# Altium project RK_NVR_DEMO1_RK3588_LP4XD200P232SD8_V21_20211228.PrjPcb (part 18 of 19)

## Sheet 92.KEY.SchDoc
size 297 x 209 mm; Revision: V2.1; Schematic Page Number: 11; Page Number: 39; Check: Default; Schematic Name: RK_NVR_DEMO1_RK3588_LP4/4x_V21; Page Count: 43; Page name: 92.KEY; Designer: Zhangdz; Schematic Page Count: 99; Revcode: V2.1; DsnPath: E:\Work\SBER\RK3588_SOM\temp\RK_NVR_DEMO1_RK3588_LP4XD200P232SD8_V21_20211228.DSN; SchematicName: RK_NVR_DEMO1_RK3588_LP4/4x_V21; PageName: 92.KEY; PageSize: A4; TopSchematic: True
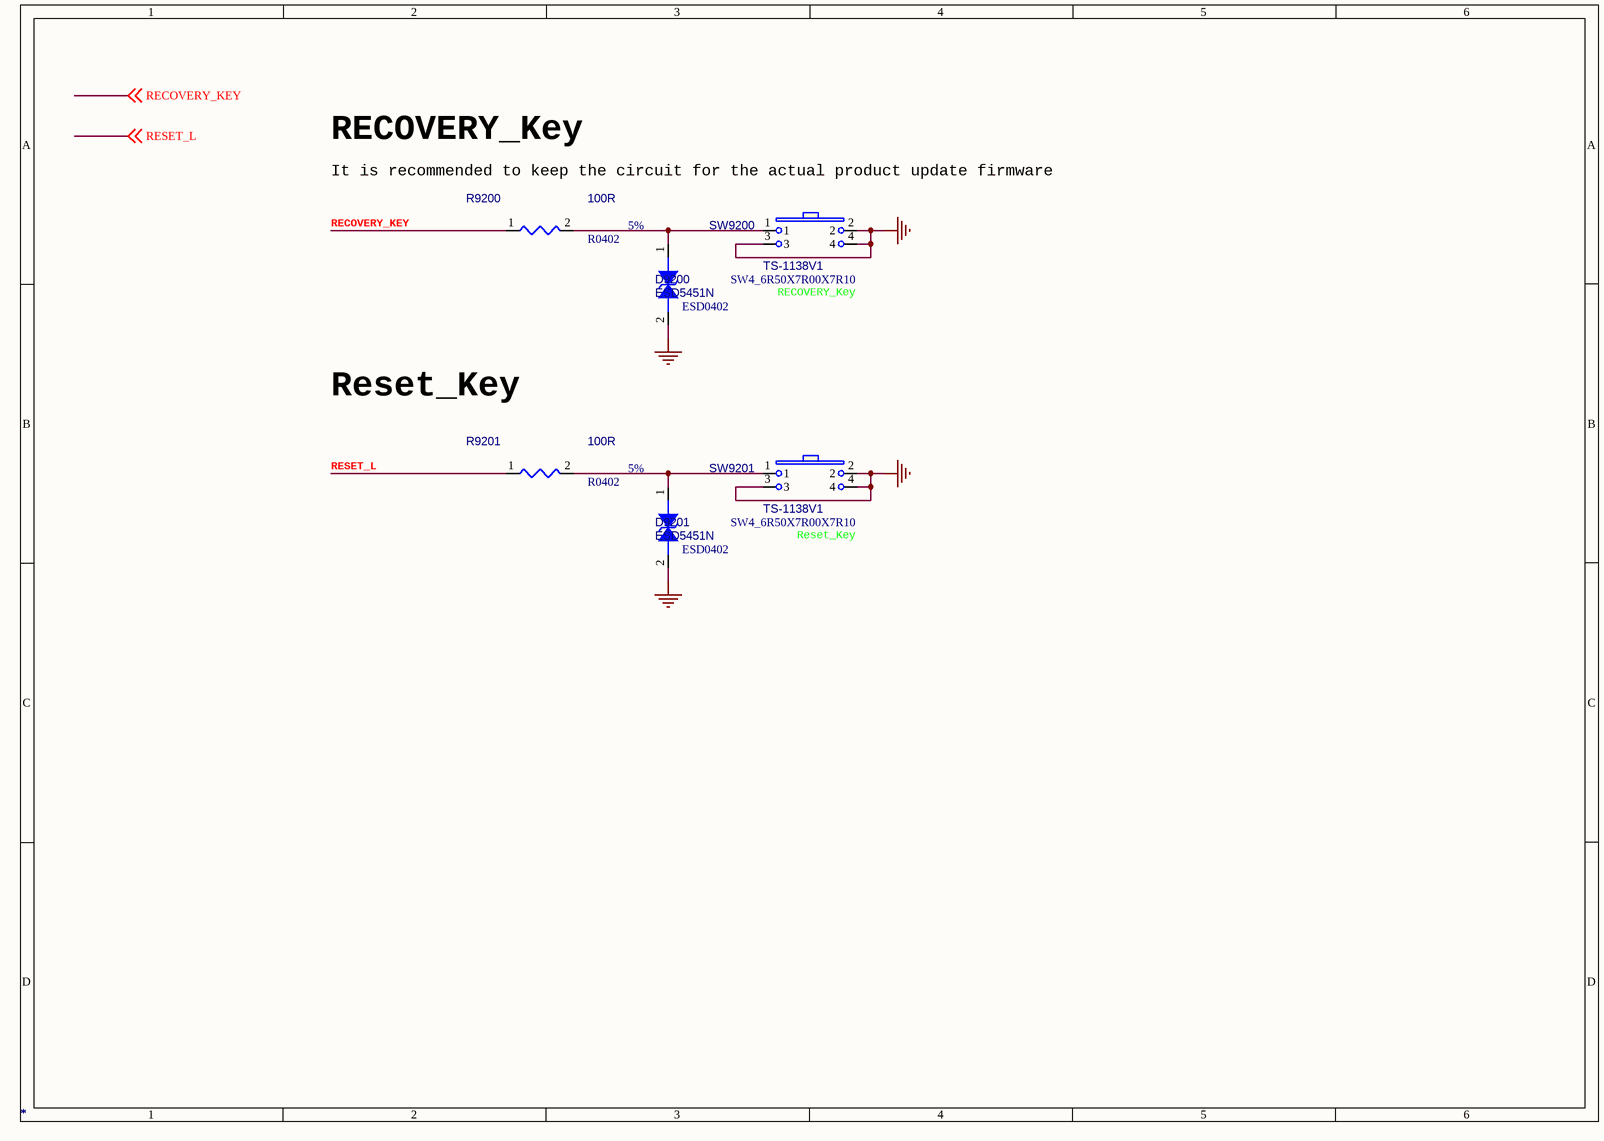
[diagram p75: 92.KEY.SchDoc]

### Parts
D9200  *  [ESD0402]
D9201  *  [ESD0402]
R9200  *  Tolerance: 5%  [R0402]
R9201  *  Tolerance: 5%  [R0402]
SW9200  *  PCB Footprint: SW4_6R50X7R00X7R10  Option: RECOVERY_Key  [YC-6615B]
SW9201  *  PCB Footprint: SW4_6R50X7R00X7R10  Option: Reset_Key  [YC-6615B]

### Nets
GND: D9200.2 D9201.2 SW9200.2 SW9200.3 SW9200.4 SW9201.2 SW9201.3 SW9201.4
RECOVERY_KEY: R9200.1 ; off-sheet RECOVERY_KEY
RESET_L: R9201.1 ; off-sheet RESET_L
NetD9200_1: D9200.1 R9200.2 SW9200.1
NetD9201_1: D9201.1 R9201.2 SW9201.1

### Notes on the sheet
- RECOVERY_Key
- It is recommended to keep the circuit for the actual product update firmware
- Reset_Key

### Library data of the parts
D9200 = DIODE BI_DIR TRIG: 1-Line, Bi-directional, Transient Voltage Suppressors.17.5pF.; Part Reference: D9200; Manufacturer: WillSemi(О¤¶ы°лµјМе); Value: ESD5451N; Priority: A; PCB Footprint: ESD0402; Created by: JJJ; Manufacturer PN: ESD5451N; Part Type: ESD_TVS; RK PN: ESD5451N
D9201 = DIODE BI_DIR TRIG: 1-Line, Bi-directional, Transient Voltage Suppressors.17.5pF.; Part Reference: D9201; Manufacturer: WillSemi(О¤¶ы°лµјМе); Value: ESD5451N; Priority: A; PCB Footprint: ESD0402; Created by: JJJ; Manufacturer PN: ESD5451N; Part Type: ESD_TVS; RK PN: ESD5451N
R9200 = RESISTOR_Dup1: НЁУГєсД¤µзЧи,100R,+/-5%,R0402,1/16W.; Part Reference: R9200; Manufacturer PN: RC0402JR-07100RL; Manufacturer: YAGEO; Wattage: 1/16W; Priority: A; PCB Footprint: R0402; Value: 100R; Created by: YTL; Part Type: НЁУГєсД¤µзЧи; RK PN: RC0402JR-07100RL
R9201 = RESISTOR_Dup1: НЁУГєсД¤µзЧи,100R,+/-5%,R0402,1/16W.; Part Reference: R9201; Manufacturer: YAGEO; RK PN: RC0402JR-07100RL; Priority: A; Wattage: 1/16W; PCB Footprint: R0402; Value: 100R; Part Type: НЁУГєсД¤µзЧи; Manufacturer PN: RC0402JR-07100RL; Created by: YTL
SW9200 = KEY_4PIN: 4ЅЕЈ¬Іа±ЯЈ¬ІејюЈ¬6.5MMx7.1MM°ґјь; Part Reference: SW9200; Manufacturer: Сw»ЄµзЧУ; Value: TS-1138V1; Priority: A; Created by: YWQ; Manufacturer Part Number: TS-1138V1; Part Type: KEY; RK PN: TS-1138V1
SW9201 = KEY_4PIN: 4ЅЕЈ¬Іа±ЯЈ¬ІејюЈ¬6.5MMx7.1MM°ґјь; Part Reference: SW9201; Manufacturer: Сw»ЄµзЧУ; Value: TS-1138V1; Priority: A; RK PN: TS-1138V1; Part Type: KEY; Manufacturer Part Number: TS-1138V1; Created by: YWQ

## Sheet 93.HW_ID.SchDoc
size 297 x 209 mm; Revision: V2.1; Schematic Page Number: 11; Page Number: 40; Check: Default; Schematic Name: RK_NVR_DEMO1_RK3588_LP4/4x_V21; Page Count: 43; Page name: 93.HW_ID; Designer: Zhangdz; Schematic Page Count: 99; Revcode: V2.1; DsnPath: E:\Work\SBER\RK3588_SOM\temp\RK_NVR_DEMO1_RK3588_LP4XD200P232SD8_V21_20211228.DSN; SchematicName: RK_NVR_DEMO1_RK3588_LP4/4x_V21; PageName: 93.HW_ID; PageSize: A4; TopSchematic: True
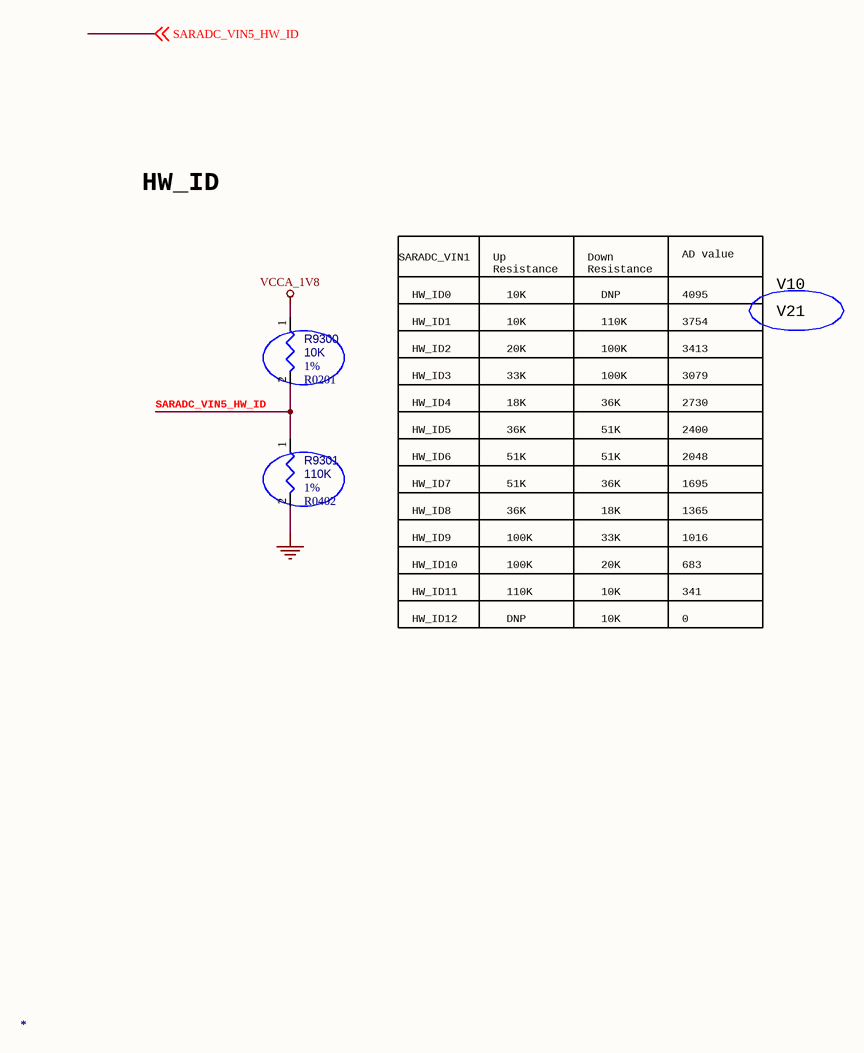
[diagram p76: 93.HW_ID.SchDoc]

### Parts
R9300  *  PCB Footprint: R0201  Tolerance: 1%  [R0402]
R9301  *  Tolerance: 1%  [R0402]

### Nets
GND: R9301.2
VCCA_1V8: R9300.1
SARADC_VIN5_HW_ID: R9300.2 R9301.1 ; off-sheet SARADC_VIN5_HW_ID

### Notes on the sheet
- HW_ID
- SARADC_VIN1
- HW_ID0
- Up
  Resistance
- 10K
- Down
  Resistance
- DNP
- AD value
- 4095
- V10
- V21
- HW_ID1
- HW_ID2
- HW_ID3
- 20K
- 33K
- 110K
- 100K
- 3413
- 3079
- 3754
- HW_ID4
- HW_ID5
- 18K
- 36K
- 51K
- 2730
- 2400
- HW_ID8
- HW_ID7
- HW_ID6
- 2048
- 1695
- 1365
- HW_ID10
- HW_ID9
- 1016
- 683
- HW_ID11
- HW_ID12
- 341
- 0

### Library data of the parts
R9300 = RESISTOR_Dup1: НЁУГєсД¤µзЧи,10K,+/-1%,R0201,1/20W.; Part Reference: R9300; Manufacturer PN: RC0201FR-0710KL; Manufacturer: YAGEO; Wattage: 1/20W; Priority: A; Value: 10K; Created by: YTL; Part Type: НЁУГєсД¤µзЧи; RK PN: RC0201FR-0710KL
R9301 = RESISTOR_Dup1: НЁУГєсД¤µзЧи,110K,+/-1%,R0402,1/16W.; Part Reference: R9301; Manufacturer PN: RC0402FR-07110KL; Manufacturer: YAGEO; Wattage: 1/16W; Priority: A; PCB Footprint: R0402; Value: 110K; Created by: YTL; Part Type: НЁУГєсД¤µзЧи; RK PN: RC0402FR-07110KL

## Sheet 95.RS485_RS232.SchDoc
size 420 x 297 mm; Revision: V2.1; Schematic Page Number: 11; Page Number: 41; Check: Default; Schematic Name: RK_NVR_DEMO1_RK3588_LP4/4x_V21; Page Count: 43; Page name: 95.RS485/RS232; Designer: Zhangdz; Schematic Page Count: 99; Revcode: V2.1; DsnPath: E:\Work\SBER\RK3588_SOM\temp\RK_NVR_DEMO1_RK3588_LP4XD200P232SD8_V21_20211228.DSN; SchematicName: RK_NVR_DEMO1_RK3588_LP4/4x_V21; PageName: 95.RS485/RS232; PageSize: A3; TopSchematic: True
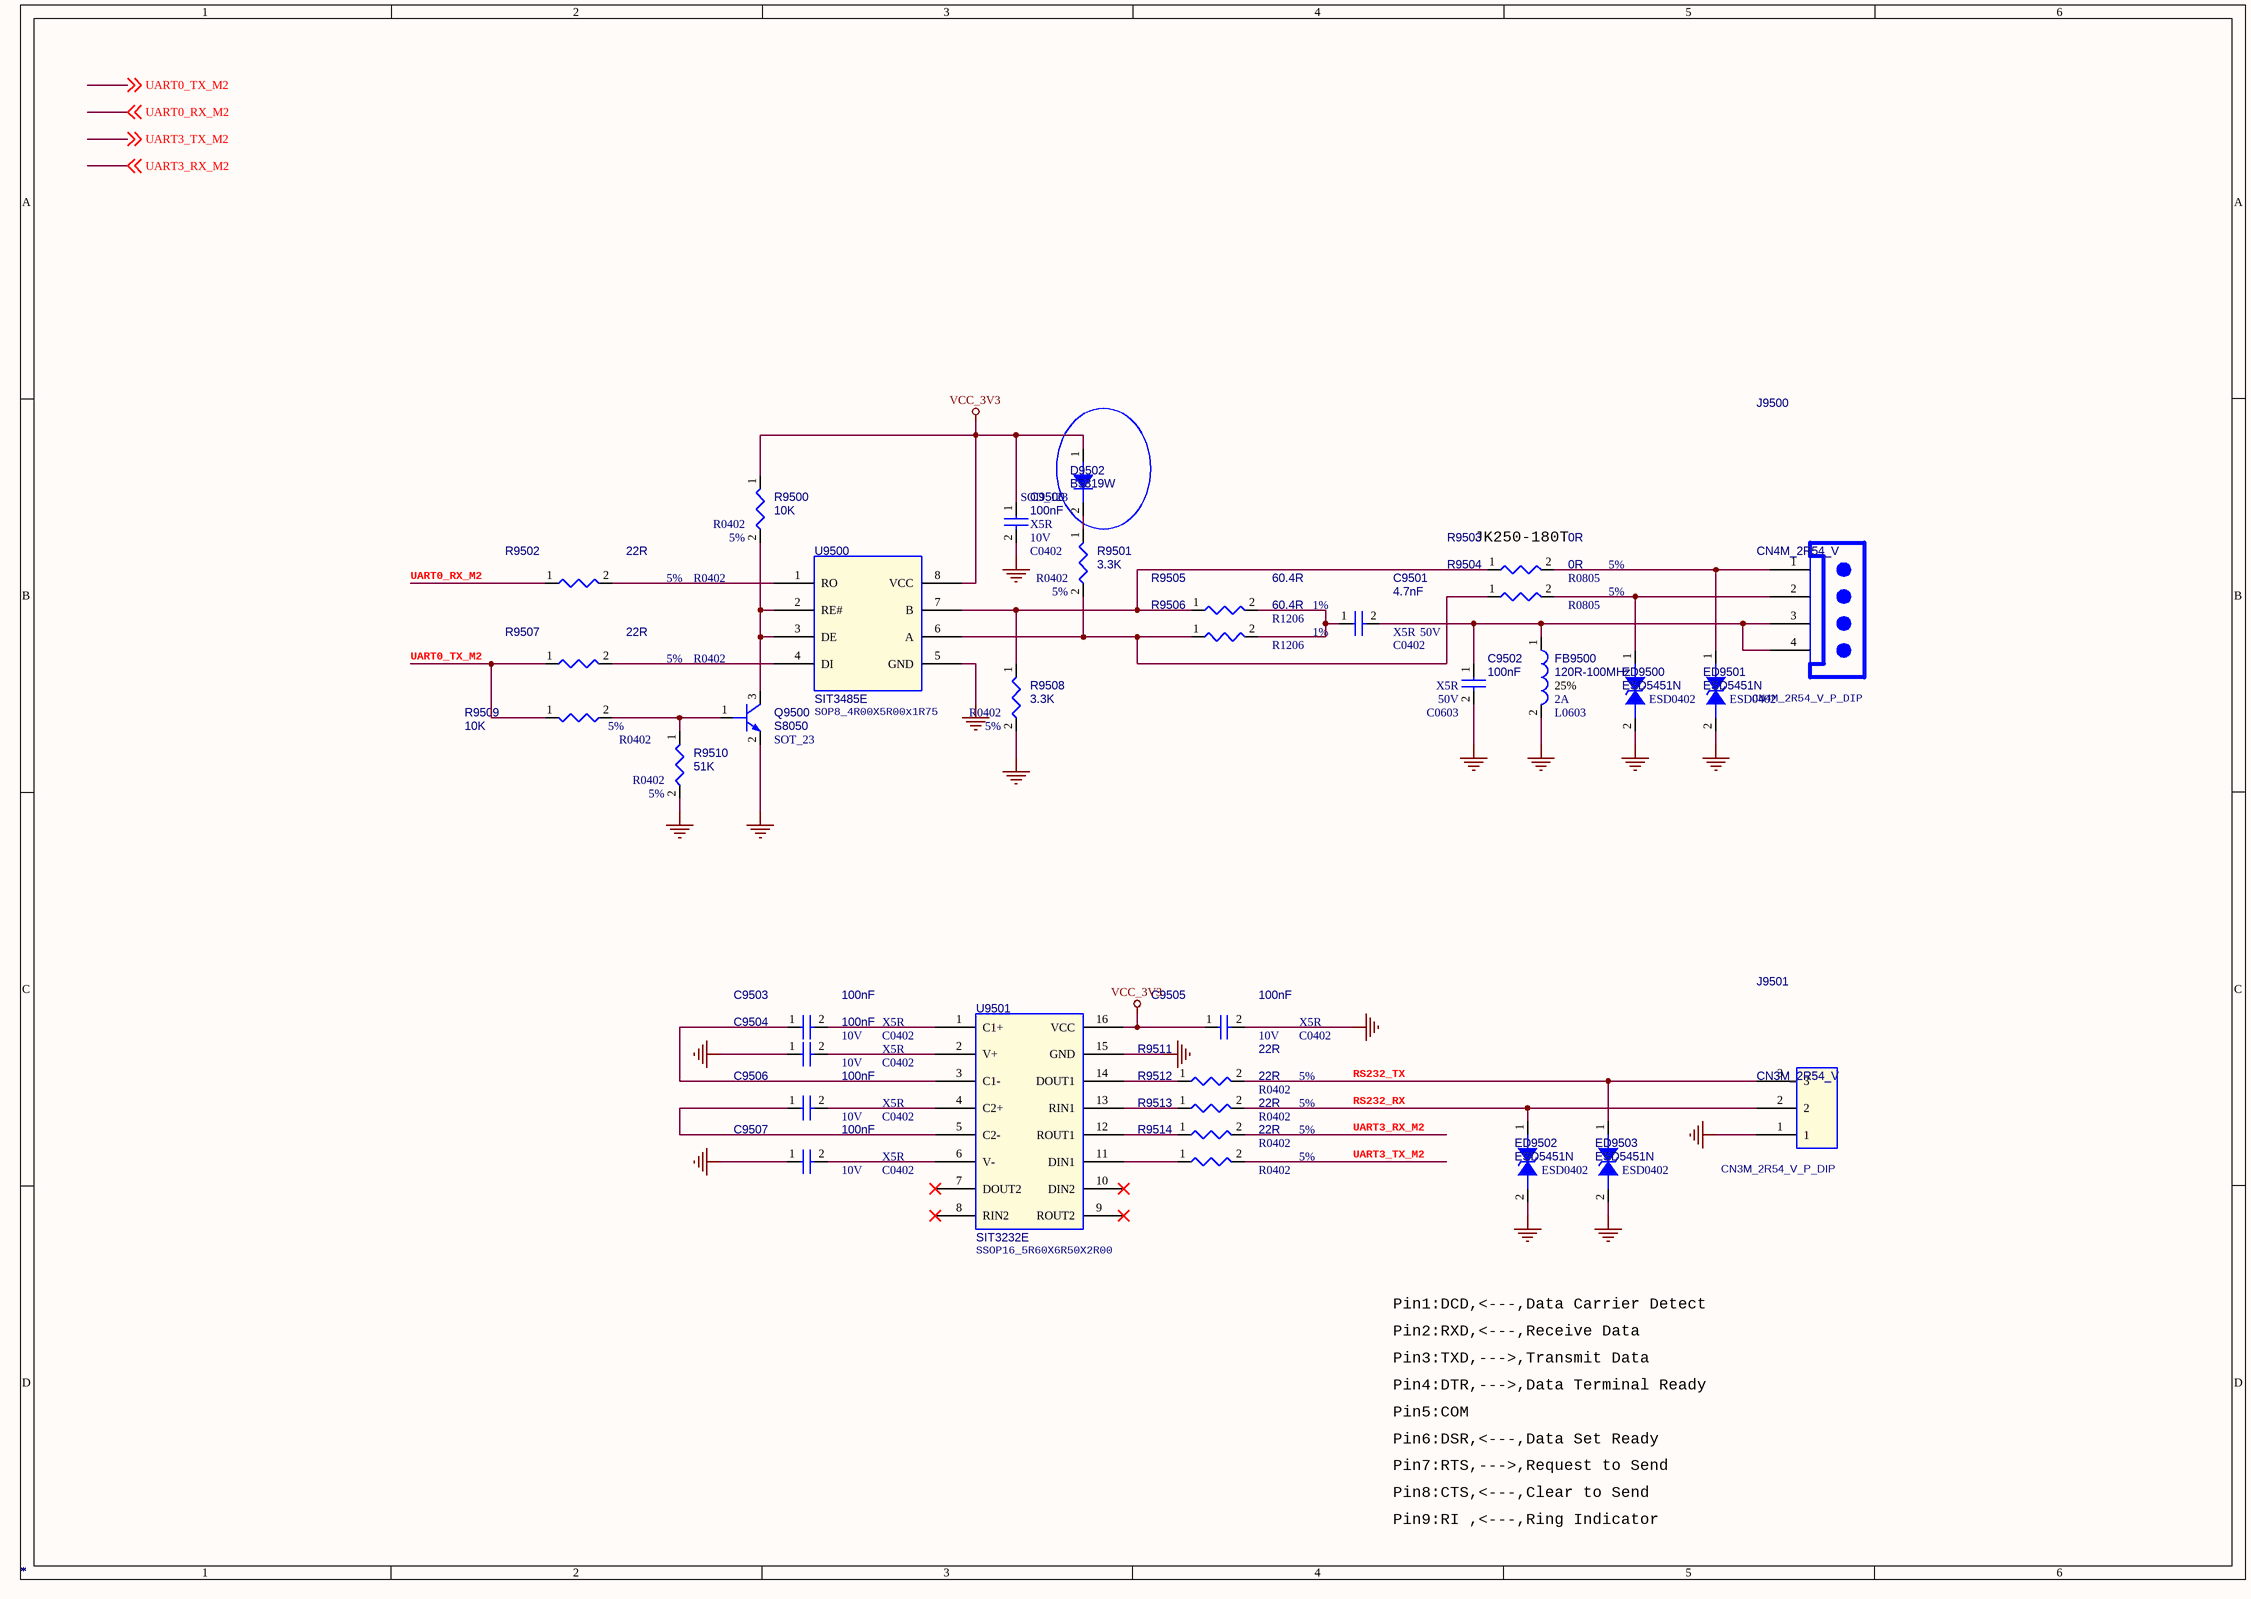
[diagram p77: 95.RS485_RS232.SchDoc]

### Parts
C9500  *  Voltage: 10V  Dielectric: X5R  [C0402]
C9501  *  Voltage: 50V  Dielectric: X5R  [C0402]
C9502  *  Voltage: 50V  Dielectric: X5R  [C0603]
C9503  *  Voltage: 10V  Dielectric: X5R  [C0402]
C9504  *  Voltage: 10V  Dielectric: X5R  [C0402]
C9505  *  Voltage: 10V  Dielectric: X5R  [C0402]
C9506  *  Voltage: 10V  Dielectric: X5R  [C0402]
C9507  *  Voltage: 10V  Dielectric: X5R  [C0402]
D9502  *  [SOD_123]
ED9500  *  [ESD0402]
ED9501  *  [ESD0402]
ED9502  *  [ESD0402]
ED9503  *  [ESD0402]
FB9500  *  Tolerance: 25%  Irms: 2A  [L0603]
J9500  *  [CN4M_2R54_V_P_DIP]
J9501  *  PCB Footprint: CN3M_2R54_V_P_DIP  [DIP3_1X3_2R54]
Q9500  *  [SOT_23]
R9500  *  Tolerance: 5%  [R0402]
R9501  *  Tolerance: 5%  [R0402]
R9502  *  Tolerance: 5%  [R0402]
R9503  *  PCB Footprint: R0805  Tolerance: 5%  [R0402]
R9504  *  PCB Footprint: R0805  Tolerance: 5%  [R0402]
R9505  *  PCB Footprint: R1206  Tolerance: 1%  [R0402]
R9506  *  PCB Footprint: R1206  Tolerance: 1%  [R0402]
R9507  *  Tolerance: 5%  [R0402]
R9508  *  Tolerance: 5%  [R0402]
R9509  *  Tolerance: 5%  [R0402]
R9510  *  Tolerance: 5%  [R0402]
R9511  *  Tolerance: 5%  [R0402]
R9512  *  Tolerance: 5%  [R0402]
R9513  *  Tolerance: 5%  [R0402]
R9514  *  Tolerance: 5%  [R0402]
U9500  *  [SOP8_4R00X5R00x1R75]
U9501  *  PCB Footprint: SSOP16_5R60X6R50X2R00  [SOP16]

### Nets
GND: C9500.2 C9502.2 C9504.1 C9505.2 C9507.1 ED9500.2 ED9501.2 ED9502.2 ED9503.2 FB9500.2 J9501.1 Q9500.2(EMITTER) R9508.2 R9510.2 U9500.5(GND) U9501.15(GND)
VCC_3V3: C9500.1 C9505.1 D9502.1(A) R9500.1 U9500.8(VCC) U9501.16(VCC)
RS232_RX: ED9502.1 J9501.2 R9512.2
RS232_TX: ED9503.1 J9501.3 R9511.2
UART0_RX_M2: R9502.1 ; off-sheet UART0_RX_M2
UART0_TX_M2: R9507.1 R9509.1 ; off-sheet UART0_TX_M2
UART3_RX_M2: R9513.2 ; off-sheet UART3_RX_M2
UART3_TX_M2: R9514.2 ; off-sheet UART3_TX_M2
NetC9501_1: C9501.1 R9505.2 R9506.2
NetC9501_2: C9501.2 C9502.1 FB9500.1 J9500.3(TX) J9500.4(3V3)
NetC9503_1: C9503.1 U9501.3(C1-)
NetC9503_2: C9503.2 U9501.1(C1+)
NetC9504_2: C9504.2 U9501.2(V+)
NetC9506_1: C9506.1 U9501.5(C2-)
NetC9506_2: C9506.2 U9501.4(C2+)
NetC9507_2: C9507.2 U9501.6(V-)
NetD9502_2: D9502.2(K) R9501.1
NetED9500_1: ED9500.1 J9500.2(RX) R9504.2
NetED9501_1: ED9501.1 J9500.1(GND) R9503.2
NetQ9500_1: Q9500.1(BASE) R9509.2 R9510.1
NetQ9500_3: Q9500.3(COLLECTOR) R9500.2 U9500.2(RE#) U9500.3(DE)
NetR9501_2: R9501.2 R9504.1 R9506.1 U9500.6(A)
NetR9502_2: R9502.2 U9500.1(RO)
NetR9503_1: R9503.1 R9505.1 R9508.1 U9500.7(B)
NetR9507_2: R9507.2 U9500.4(DI)
NetR9511_1: R9511.1 U9501.14(DOUT1)
NetR9512_1: R9512.1 U9501.13(RIN1)
NetR9513_1: R9513.1 U9501.12(ROUT1)
NetR9514_1: R9514.1 U9501.11(DIN1)

Not connected (* = marked no-connect by the designer): U9501 7(DOUT2)* 8(RIN2)* 9(ROUT2)* 10(DIN2)*

### Notes on the sheet
- (near R9503) JK250-180T
- Pin1:DCD,<---,Data Carrier Detect
- Pin2:RXD,<---,Receive Data
- Pin3:TXD,--->,Transmit Data
- Pin4:DTR,--->,Data Terminal Ready
- Pin5:COM
- Pin6:DSR,<---,Data Set Ready
- Pin7:RTS,--->,Request to Send
- Pin8:CTS,<---,Clear to Send
- Pin9:RI ,<---,Ring Indicator

### Library data of the parts
C9500 = CAP NP: cap,100.00nF,+/-10%,10V,X5R,C0402; Part Reference: C9500; Manufacturer PN: C1005X5R1A104K050BA; Manufacturer: TDK; Value: 100nF; C_Voltage: 6.3V; Tolerance: 10%; Priority: A; Number: 37; PCB Footprint: C0402; Created by: JJJ; Part Type: C0402; RK PN: C1005X5R1A104K050BA
C9501 = CAP NP: cap,4.70nF,+/-10%,50V,X5R,C0402; Part Reference: C9501; Manufacturer PN: C1005X5R1H472K050BA; Manufacturer: TDK; Value: 4.7nF; Tolerance: 10%; Priority: A; PCB Footprint: C0402; Created by: JJJ; C_Voltage: 50V; Part Type: C0402; RK PN: C1005X5R1H472K050BA
C9502 = CAP NP: cap,100.00nF,+/-10%,50V,X5R,C0603; Part Reference: C9502; Manufacturer: TDK; Value: 100nF; RK PN: C1608X5R1H104K080AA; Priority: A; C_Voltage: 6.3V; Tolerance: 10%; PCB Footprint: C0603; Part Type: C0603; Manufacturer PN: C1608X5R1H104K080AA; Created by: JJJ
C9503 = CAP NP: cap,100.00nF,+/-10%,10V,X5R,C0402; Part Reference: C9503; Manufacturer: TDK; Value: 100nF; Number: 37; RK PN: C1005X5R1A104K050BA; Priority: A; Tolerance: 10%; C_Voltage: 6.3V; PCB Footprint: C0402; Part Type: C0402; Manufacturer PN: C1005X5R1A104K050BA; Created by: JJJ
C9504 = CAP NP: cap,100.00nF,+/-10%,10V,X5R,C0402; Part Reference: C9504; Manufacturer: TDK; Value: 100nF; Number: 37; RK PN: C1005X5R1A104K050BA; Priority: A; Tolerance: 10%; C_Voltage: 6.3V; PCB Footprint: C0402; Part Type: C0402; Manufacturer PN: C1005X5R1A104K050BA; Created by: JJJ
C9505 = CAP NP: cap,100.00nF,+/-10%,10V,X5R,C0402; Part Reference: C9505; Manufacturer: TDK; Value: 100nF; Number: 37; RK PN: C1005X5R1A104K050BA; Priority: A; Tolerance: 10%; C_Voltage: 6.3V; PCB Footprint: C0402; Part Type: C0402; Manufacturer PN: C1005X5R1A104K050BA; Created by: JJJ
C9506 = CAP NP: cap,100.00nF,+/-10%,10V,X5R,C0402; Part Reference: C9506; Manufacturer: TDK; Value: 100nF; Number: 37; RK PN: C1005X5R1A104K050BA; Priority: A; Tolerance: 10%; C_Voltage: 6.3V; PCB Footprint: C0402; Part Type: C0402; Manufacturer PN: C1005X5R1A104K050BA; Created by: JJJ
C9507 = CAP NP: cap,100.00nF,+/-10%,10V,X5R,C0402; Part Reference: C9507; Manufacturer PN: C1005X5R1A104K050BA; Manufacturer: TDK; Value: 100nF; C_Voltage: 6.3V; Tolerance: 10%; Priority: A; Number: 37; PCB Footprint: C0402; Created by: JJJ; Part Type: C0402; RK PN: C1005X5R1A104K050BA
D9502 = DIODE: Schottky BarrierЈ¬B5819W SOD-123; Part Reference: D9502; Manufacturer: і¤µз; Value: B5819W; Priority: A; PCB Footprint: SOD_123; RK PN: B5819W; Part Type: Schottky rectifier; Manufacturer PN: B5819W; Created by: JJJ
ED9500 = DIODE BI_DIR TRIG: 1-Line, Bi-directional, Transient Voltage Suppressors.17.5pF.; Part Reference: ED9500; Manufacturer: WillSemi(О¤¶ы°лµјМе); Value: ESD5451N; Priority: A; PCB Footprint: ESD0402; Created by: JJJ; Manufacturer PN: ESD5451N; Part Type: ESD_TVS; RK PN: ESD5451N
ED9501 = DIODE BI_DIR TRIG: 1-Line, Bi-directional, Transient Voltage Suppressors.17.5pF.; Part Reference: ED9501; Manufacturer: WillSemi(О¤¶ы°лµјМе); Value: ESD5451N; Priority: A; PCB Footprint: ESD0402; Created by: JJJ; Manufacturer PN: ESD5451N; Part Type: ESD_TVS; RK PN: ESD5451N
ED9502 = DIODE BI_DIR TRIG: 1-Line, Bi-directional, Transient Voltage Suppressors.17.5pF.; Part Reference: ED9502; Manufacturer: WillSemi(О¤¶ы°лµјМе); Value: ESD5451N; Priority: A; PCB Footprint: ESD0402; Created by: JJJ; Manufacturer PN: ESD5451N; Part Type: ESD_TVS; RK PN: ESD5451N
ED9503 = DIODE BI_DIR TRIG: 1-Line, Bi-directional, Transient Voltage Suppressors.17.5pF.; Part Reference: ED9503; Manufacturer: WillSemi(О¤¶ы°лµјМе); Value: ESD5451N; Priority: A; PCB Footprint: ESD0402; Created by: JJJ; Manufacturer PN: ESD5451N; Part Type: ESD_TVS; RK PN: ESD5451N
FB9500 = BEAD: BEAD,120R@100MHz,current=2000mA,0603; Part Reference: FB9500; Manufacturer PN: BLM18KG121TN1; Manufacturer: Murata; DC Resistor: 0.030ohm; Value: 120R-100MHz; Priority: L; PCB Footprint: L0603; Created by: DZS; Part Type: BEAD; RK PN: BLM18KG121TN1
J9500 = CON4_0: Part Reference: J9500; Value: CN4M_2R54_V; PCB Footprint: CN4M_2R54_V_P_DIP
J9501 = CON3_1X3: µҐЕЕ3PINЈЁјдѕа2.54mmЈ©І»ґш·А»¤ЗЅµДІеХл; Part Reference: J9501; Manufacturer Part Number: CON3M_1X3_2R54_V; Manufacturer: НъїЖґп; Value: CN3M_2R54_V; Priority: A; Created by: JJJ; Part Type: Header; RK PN: CON3M_1X3_2R54_V
Q9500 = NPN: S8050,SOT23; Part Reference: Q9500; Manufacturer PN: S8050_SOT23; Manufacturer: і¤µз; Pc: 0.3W; Vceo: 25V; Ic: 0.5A; Priority: A; PCB Footprint: SOT_23; Value: S8050; Created by: JJJ; Part Type: NPN; RK PN: S8050
R9500 = RESISTOR_Dup1: НЁУГєсД¤µзЧи,10K,+/-5%,R0402,1/16W.; Part Reference: R9500; Manufacturer PN: RC0402JR-0710KL; Manufacturer: YAGEO; Wattage: 1/16W; Priority: A; PCB Footprint: R0402; Value: 10K; Created by: YTL; Part Type: НЁУГєсД¤µзЧи; RK PN: RC0402JR-0710KL
R9501 = RESISTOR_Dup1: НЁУГєсД¤µзЧи,3K3,+/-5%,R0402,1/16W.; Part Reference: R9501; Manufacturer PN: RC0402JR-073K3L; Manufacturer: YAGEO; Value: 3.3K; Wattage: 1/16W; Priority: A; PCB Footprint: R0402; Created by: YTL; Part Type: НЁУГєсД¤µзЧи; RK PN: RC0402JR-073K3L
R9502 = RESISTOR_Dup1: НЁУГєсД¤µзЧи,22R,+/-5%,R0402,1/16W.; Part Reference: R9502; Manufacturer: YAGEO; RK PN: RC0402JR-0722RL; Priority: A; Wattage: 1/16W; PCB Footprint: R0402; Value: 22R; Part Type: НЁУГєсД¤µзЧи; Manufacturer PN: RC0402JR-0722RL; Created by: YTL
R9503 = RESISTOR_Dup1: НЁУГєсД¤µзЧи,0R,+/-5%,R0805,1/8W.; Part Reference: R9503; Manufacturer PN: RC0805JR-070RL; Manufacturer: YAGEO; Wattage: 1/8W; Priority: A; Value: 0R; Created by: YTL; Part Type: НЁУГєсД¤µзЧи; RK PN: RC0805JR-070RL
R9504 = RESISTOR_Dup1: НЁУГєсД¤µзЧи,0R,+/-5%,R0805,1/8W.; Part Reference: R9504; Manufacturer: YAGEO; RK PN: RC0805JR-070RL; Priority: A; Wattage: 1/8W; Value: 0R; Part Type: НЁУГєсД¤µзЧи; Manufacturer PN: RC0805JR-070RL; Created by: YTL
R9505 = RESISTOR_Dup1: НЁУГєсД¤µзЧи,60R4,+/-1%,R1206,1/4W.; Part Reference: R9505; Manufacturer PN: RC1206FR-0760R4L; Manufacturer: YAGEO; Value: 60.4R; Wattage: 1/4W; Priority: A; Created by: YTL; Part Type: НЁУГєсД¤µзЧи; RK PN: RC1206FR-0760R4L
R9506 = RESISTOR_Dup1: НЁУГєсД¤µзЧи,60R4,+/-1%,R1206,1/4W.; Part Reference: R9506; Manufacturer: YAGEO; Value: 60.4R; RK PN: RC1206FR-0760R4L; Priority: A; Wattage: 1/4W; Part Type: НЁУГєсД¤µзЧи; Manufacturer PN: RC1206FR-0760R4L; Created by: YTL
R9507 = RESISTOR_Dup1: НЁУГєсД¤µзЧи,22R,+/-5%,R0402,1/16W.; Part Reference: R9507; Manufacturer: YAGEO; RK PN: RC0402JR-0722RL; Priority: A; Wattage: 1/16W; PCB Footprint: R0402; Value: 22R; Part Type: НЁУГєсД¤µзЧи; Manufacturer PN: RC0402JR-0722RL; Created by: YTL
R9508 = RESISTOR_Dup1: НЁУГєсД¤µзЧи,3K3,+/-5%,R0402,1/16W.; Part Reference: R9508; Manufacturer PN: RC0402JR-073K3L; Manufacturer: YAGEO; Value: 3.3K; Wattage: 1/16W; Priority: A; PCB Footprint: R0402; Created by: YTL; Part Type: НЁУГєсД¤µзЧи; RK PN: RC0402JR-073K3L
R9509 = RESISTOR_Dup1: НЁУГєсД¤µзЧи,10K,+/-5%,R0402,1/16W.; Part Reference: R9509; Manufacturer PN: RC0402JR-0710KL; Manufacturer: YAGEO; Wattage: 1/16W; Priority: A; PCB Footprint: R0402; Value: 10K; Created by: YTL; Part Type: НЁУГєсД¤µзЧи; RK PN: RC0402JR-0710KL
R9510 = RESISTOR_Dup1: НЁУГєсД¤µзЧи,51K,+/-5%,R0402,1/16W.; Part Reference: R9510; Manufacturer PN: RC0402JR-0751KL; Manufacturer: YAGEO; Wattage: 1/16W; Priority: A; PCB Footprint: R0402; Value: 51K; Created by: YTL; Part Type: НЁУГєсД¤µзЧи; RK PN: RC0402JR-0751KL
R9511 = RESISTOR_Dup1: НЁУГєсД¤µзЧи,22R,+/-5%,R0402,1/16W.; Part Reference: R9511; Manufacturer: YAGEO; RK PN: RC0402JR-0722RL; Priority: A; Wattage: 1/16W; PCB Footprint: R0402; Value: 22R; Part Type: НЁУГєсД¤µзЧи; Manufacturer PN: RC0402JR-0722RL; Created by: YTL
R9512 = RESISTOR_Dup1: НЁУГєсД¤µзЧи,22R,+/-5%,R0402,1/16W.; Part Reference: R9512; Manufacturer PN: RC0402JR-0722RL; Manufacturer: YAGEO; Wattage: 1/16W; Priority: A; PCB Footprint: R0402; Value: 22R; Created by: YTL; Part Type: НЁУГєсД¤µзЧи; RK PN: RC0402JR-0722RL
R9513 = RESISTOR_Dup1: НЁУГєсД¤µзЧи,22R,+/-5%,R0402,1/16W.; Part Reference: R9513; Manufacturer: YAGEO; RK PN: RC0402JR-0722RL; Priority: A; Wattage: 1/16W; PCB Footprint: R0402; Value: 22R; Part Type: НЁУГєсД¤µзЧи; Manufacturer PN: RC0402JR-0722RL; Created by: YTL
R9514 = RESISTOR_Dup1: НЁУГєсД¤µзЧи,22R,+/-5%,R0402,1/16W.; Part Reference: R9514; Manufacturer: YAGEO; RK PN: RC0402JR-0722RL; Priority: A; Wattage: 1/16W; PCB Footprint: R0402; Value: 22R; Part Type: НЁУГєсД¤µзЧи; Manufacturer PN: RC0402JR-0722RL; Created by: YTL
U9500 = MAX3485_0: Part Reference: U9500; Value: SIT3485E; PCB Footprint: SOP8_4R00X5R00x1R75
U9501 = MAX3232/SIT3232E: Part Reference: U9501; Value: SIT3232E

## Sheet 98.Power Test.SchDoc
size 297 x 209 mm; Revision: V2.1; Schematic Page Number: 11; Page Number: 42; Check: <Checker>; Schematic Name: RK_NVR_DEMO1_RK3588_LP4/4x_V21; Page Count: 43; Page name: 98.Power Test; Designer: Zhangdz; Schematic Page Count: 99; Revcode: V2.1; DsnPath: E:\Work\SBER\RK3588_SOM\temp\RK_NVR_DEMO1_RK3588_LP4XD200P232SD8_V21_20211228.DSN; SchematicName: RK_NVR_DEMO1_RK3588_LP4/4x_V21; PageName: 98.Power Test; PageSize: A4; TopSchematic: True
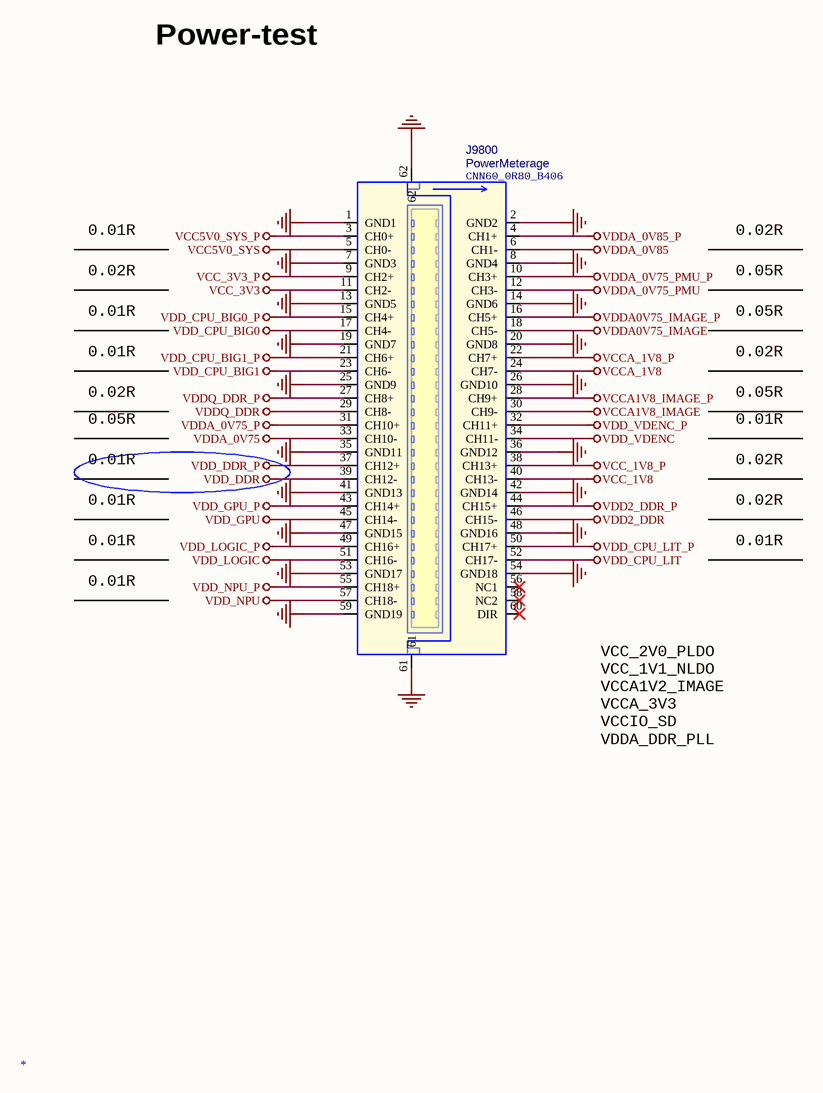
[diagram p78: 98.Power Test.SchDoc]

### Parts
J9800  *  [CNN60_0R80_B406]

### Nets
GND: J9800.1(GND1) J9800.2(GND2) J9800.7(GND3) J9800.8(GND4) J9800.13(GND5) J9800.14(GND6) J9800.19(GND7) J9800.20(GND8) J9800.25(GND9) J9800.26(GND10) J9800.35(GND11) J9800.36(GND12) J9800.41(GND13) J9800.42(GND14) J9800.47(GND15) J9800.48(GND16) J9800.53(GND17) J9800.54(GND18) J9800.59(GND19) J9800.61 J9800.62
VCC5V0_SYS: J9800.5(CH0-)
VCC5V0_SYS_P: J9800.3(CH0+)
VCC_1V8: J9800.40(CH13-)
VCC_1V8_P: J9800.38(CH13+)
VCC_3V3: J9800.11(CH2-)
VCC_3V3_P: J9800.9(CH2+)
VCCA1V8_IMAGE: J9800.30(CH9-)
VCCA1V8_IMAGE_P: J9800.28(CH9+)
VCCA_1V8: J9800.24(CH7-)
VCCA_1V8_P: J9800.22(CH7+)
VDD2_DDR: J9800.46(CH15-)
VDD2_DDR_P: J9800.44(CH15+)
VDD_CPU_BIG0: J9800.17(CH4-)
VDD_CPU_BIG0_P: J9800.15(CH4+)
VDD_CPU_BIG1: J9800.23(CH6-)
VDD_CPU_BIG1_P: J9800.21(CH6+)
VDD_CPU_LIT: J9800.52(CH17-)
VDD_CPU_LIT_P: J9800.50(CH17+)
VDD_DDR: J9800.39(CH12-)
VDD_DDR_P: J9800.37(CH12+)
VDD_GPU: J9800.45(CH14-)
VDD_GPU_P: J9800.43(CH14+)
VDD_LOGIC: J9800.51(CH16-)
VDD_LOGIC_P: J9800.49(CH16+)
VDD_NPU: J9800.57(CH18-)
VDD_NPU_P: J9800.55(CH18+)
VDD_VDENC: J9800.34(CH11-)
VDD_VDENC_P: J9800.32(CH11+)
VDDA0V75_IMAGE: J9800.18(CH5-)
VDDA0V75_IMAGE_P: J9800.16(CH5+)
VDDA_0V75: J9800.33(CH10-)
VDDA_0V75_P: J9800.31(CH10+)
VDDA_0V75_PMU: J9800.12(CH3-)
VDDA_0V75_PMU_P: J9800.10(CH3+)
VDDA_0V85: J9800.6(CH1-)
VDDA_0V85_P: J9800.4(CH1+)
VDDQ_DDR: J9800.29(CH8-)
VDDQ_DDR_P: J9800.27(CH8+)

Not connected (* = marked no-connect by the designer): J9800 56(NC1)* 58(NC2)* 60(DIR)*

### Notes on the sheet
- Power-test
- 0.02R
- 0.01R
- 0.05R
- VCC_2V0_PLDO
  VCC_1V1_NLDO
  VCCA1V2_IMAGE
  VCCA_3V3
  VCCIO_SD
  VDDA_DDR_PLL

### Library data of the parts
J9800 = PowerMeasurement_6: Part Reference: J9800; Value: PowerMeterage; PCB Footprint: CNN60_0R80_B406

## Sheet 99.Mark_Hole_Heatsink.SchDoc
size 297 x 209 mm; Revision: V2.1; Schematic Page Number: 11; Page Number: 43; Check: Default; Schematic Name: RK_NVR_DEMO1_RK3588_LP4/4x_V21; Page Count: 43; Page name: 99.Mark/Hole/Heatsink; Designer: Zhangdz; Schematic Page Count: 99; Revcode: V2.1; DsnPath: E:\Work\SBER\RK3588_SOM\temp\RK_NVR_DEMO1_RK3588_LP4XD200P232SD8_V21_20211228.DSN; SchematicName: RK_NVR_DEMO1_RK3588_LP4/4x_V21; PageName: 99.Mark/Hole/Heatsink; PageSize: A4; TopSchematic: True
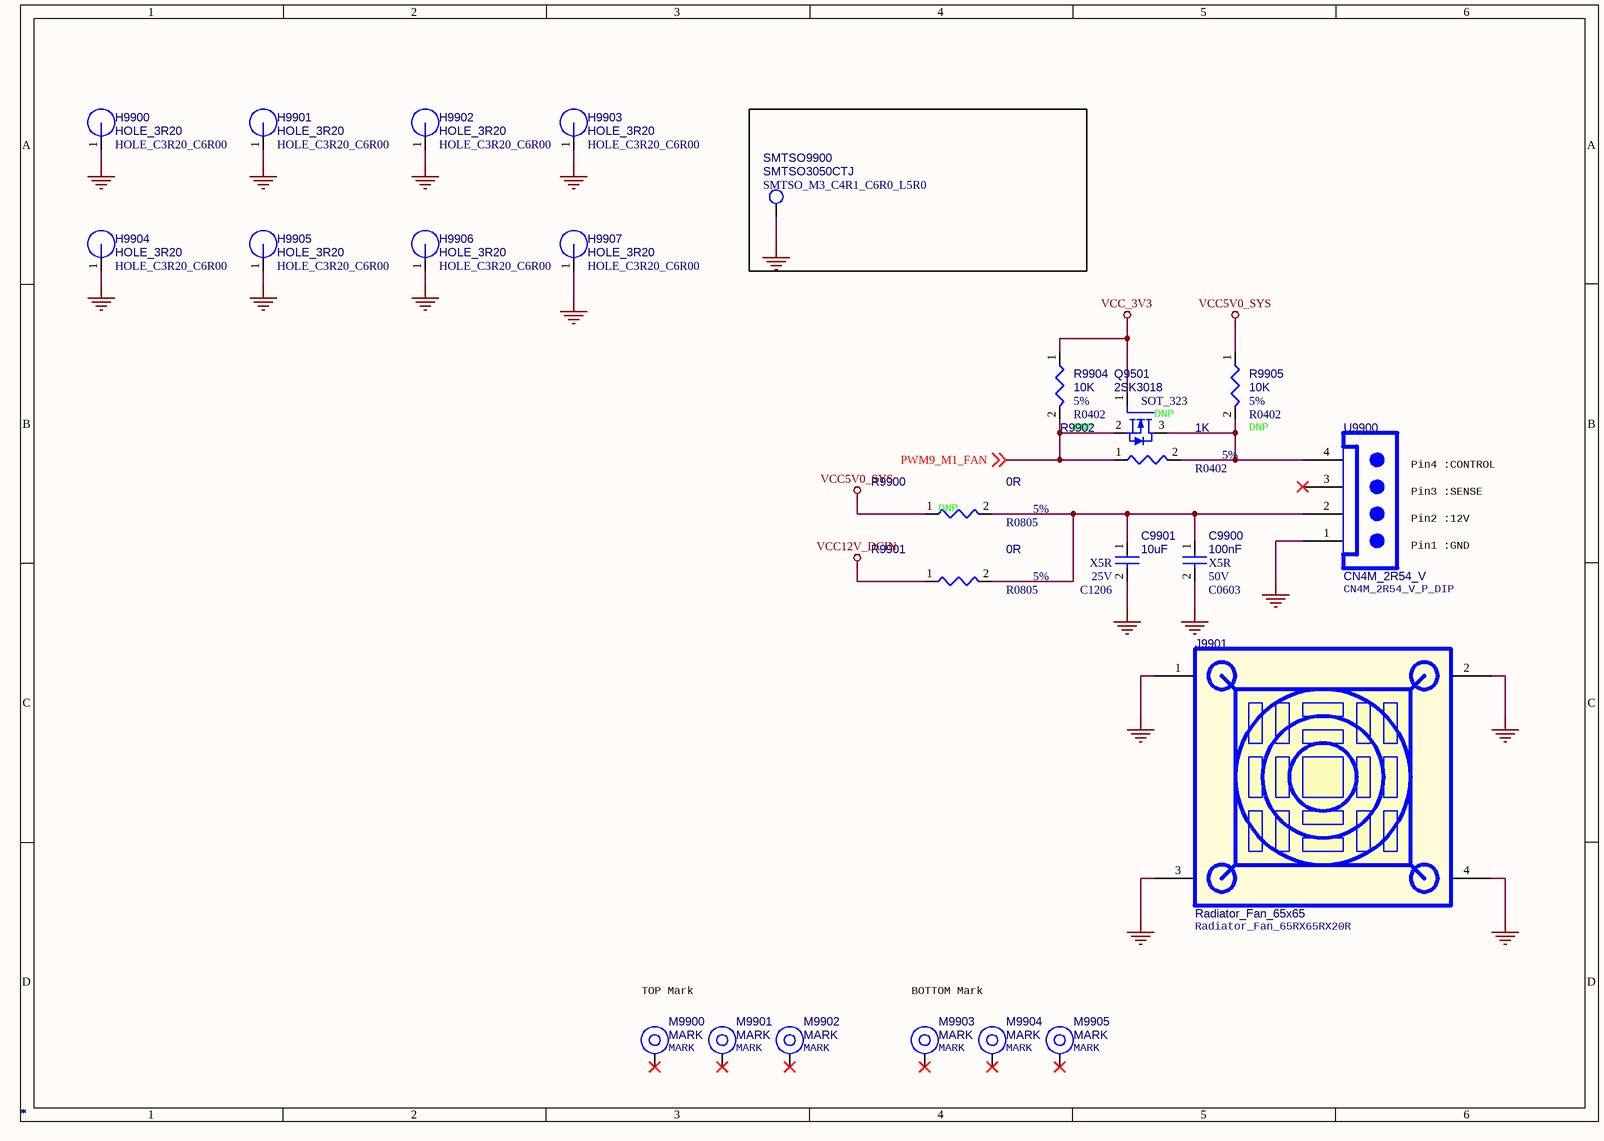
[diagram p79: 99.Mark_Hole_Heatsink.SchDoc]

### Parts
C9900  *  Voltage: 50V  Dielectric: X5R  [C0603]
C9901  *  Voltage: 25V  Dielectric: X5R  [C1206]
H9900  *  PCB Footprint: HOLE_C3R20_C6R00  [H3.8MM]
H9901  *  PCB Footprint: HOLE_C3R20_C6R00  [H3.8MM]
H9902  *  PCB Footprint: HOLE_C3R20_C6R00  [H3.8MM]
H9903  *  PCB Footprint: HOLE_C3R20_C6R00  [H3.8MM]
H9904  *  PCB Footprint: HOLE_C3R20_C6R00  [H3.8MM]
H9905  *  PCB Footprint: HOLE_C3R20_C6R00  [H3.8MM]
H9906  *  PCB Footprint: HOLE_C3R20_C6R00  [H3.8MM]
H9907  *  PCB Footprint: HOLE_C3R20_C6R00  [H3.8MM]
J9901  *  [Radiator_Fan_65RX65RX20R]
M9900  *  [MARK]
M9901  *  [MARK]
M9902  *  [MARK]
M9903  *  [MARK]
M9904  *  [MARK]
M9905  *  [MARK]
Q9501  *  PCB Footprint: SOT_323  OPTION: DNP  [SOT23]
R9900  *  PCB Footprint: R0805  Tolerance: 5%  OPTION: DNP  [R0402]
R9901  *  PCB Footprint: R0805  Tolerance: 5%  [R0402]
R9902  *  Tolerance: 5%  [R0402]
R9904  *  Tolerance: 5%  OPTION: DNP  [R0402]
R9905  *  Tolerance: 5%  OPTION: DNP  [R0402]
SMTSO9900  *  PCB Footprint: SMTSO_M3_C4R1_C6R0_L5R0  [TEST]
U9900  *  [CN4M_2R54_V_P_DIP]

### Nets
GND: C9900.2 C9901.2 H9900.1 H9901.1 H9902.1 H9903.1 H9904.1 H9905.1 H9906.1 H9907.1 J9901.1 J9901.2 J9901.3 J9901.4 SMTSO9900.1 U9900.1(GND)
VCC5V0_SYS: R9900.1 R9905.1
VCC12V_DCIN: R9901.1
VCC_3V3: Q9501.1(GATE) R9904.1
PWM9_M1_FAN: Q9501.2(SOURCE) R9902.1 R9904.2 ; off-sheet PWM9_M1_FAN
NetC9900_1: C9900.1 C9901.1 R9900.2 R9901.2 U9900.2(RX)
NetQ9501_3: Q9501.3(DRAIN) R9902.2 R9905.2 U9900.4(3V3)

Not connected (* = marked no-connect by the designer): M9900 1*; M9901 1*; M9902 1*; M9903 1*; M9904 1*; M9905 1*; U9900 3(TX)*

### Notes on the sheet
- Pin4 :CONTROL
- Pin2 :12V
- Pin3 :SENSE
- Pin1 :GND
- TOP Mark
- BOTTOM Mark

### Library data of the parts
C9900 = CAP NP: cap,100.00nF,+/-10%,50V,X5R,C0603; Part Reference: C9900; Manufacturer: TDK; Value: 100nF; RK PN: C1608X5R1H104K080AA; Priority: A; Tolerance: 10%; PCB Footprint: C0603; Part Type: C0603; Manufacturer PN: C1608X5R1H104K080AA; Created by: JJJ
C9901 = CAP NP: cap,10.00uF,+/-10%,25V,X5R,C1206; Part Reference: C9901; Manufacturer PN: C3216X5R1E106K085AC; Manufacturer: TDK; Value: 10uF; Tolerance: 10%; C_Voltage: 6.3V; Priority: A; PCB Footprint: C1206; Created by: JJJ; Part Type: C1206; RK PN: C3216X5R1E106K085AC
H9900 = Hole: Ц±ѕ¶3.2mmВЭЛїїЧ,ОЮН­Цщ; Part Reference: H9900; Value: HOLE_3R20; Priority: A; RK PN: HOLE_3R20; Part Type: HOLE; Created by: YWQ
H9901 = Hole: Ц±ѕ¶3.2mmВЭЛїїЧ,ОЮН­Цщ; Part Reference: H9901; Value: HOLE_3R20; Priority: A; RK PN: HOLE_3R20; Part Type: HOLE; Created by: YWQ
H9902 = Hole: Ц±ѕ¶3.2mmВЭЛїїЧ,ОЮН­Цщ; Part Reference: H9902; Value: HOLE_3R20; Priority: A; RK PN: HOLE_3R20; Part Type: HOLE; Created by: YWQ
H9903 = Hole: Ц±ѕ¶3.2mmВЭЛїїЧ,ОЮН­Цщ; Part Reference: H9903; Value: HOLE_3R20; Priority: A; RK PN: HOLE_3R20; Part Type: HOLE; Created by: YWQ
H9904 = Hole: Ц±ѕ¶3.2mmВЭЛїїЧ,ОЮН­Цщ; Part Reference: H9904; Value: HOLE_3R20; Priority: A; Created by: YWQ; Part Type: HOLE; RK PN: HOLE_3R20
H9905 = Hole: Ц±ѕ¶3.2mmВЭЛїїЧ,ОЮН­Цщ; Part Reference: H9905; Value: HOLE_3R20; Priority: A; RK PN: HOLE_3R20; Part Type: HOLE; Created by: YWQ
H9906 = Hole: Ц±ѕ¶3.2mmВЭЛїїЧ,ОЮН­Цщ; Part Reference: H9906; Value: HOLE_3R20; Priority: A; Created by: YWQ; Part Type: HOLE; RK PN: HOLE_3R20
H9907 = Hole: Ц±ѕ¶3.2mmВЭЛїїЧ,ОЮН­Цщ; Part Reference: H9907; Value: HOLE_3R20; Priority: A; RK PN: HOLE_3R20; Part Type: HOLE; Created by: YWQ
J9901 = Radiator_Fan_2: Part Reference: J9901; Value: Radiator_Fan_65x65; PCB Footprint: Radiator_Fan_65RX65RX20R
M9900 = MARK: MARK Symble; Part Reference: M9900; RK PN: MARK01; Priority: A; PCB Footprint: MARK; Value: MARK; Part Type: MARK; Created by: JJJ
M9901 = MARK: MARK Symble; Part Reference: M9901; RK PN: MARK01; Priority: A; PCB Footprint: MARK; Value: MARK; Part Type: MARK; Created by: JJJ
M9902 = MARK: MARK Symble; Part Reference: M9902; RK PN: MARK01; Priority: A; PCB Footprint: MARK; Value: MARK; Part Type: MARK; Created by: JJJ
M9903 = MARK: MARK Symble; Part Reference: M9903; Priority: A; RK PN: MARK01; PCB Footprint: MARK; Value: MARK; Created by: JJJ; Part Type: MARK
M9904 = MARK: MARK Symble; Part Reference: M9904; Priority: A; RK PN: MARK01; PCB Footprint: MARK; Value: MARK; Created by: JJJ; Part Type: MARK
M9905 = MARK: MARK Symble; Part Reference: M9905; RK PN: MARK01; Priority: A; PCB Footprint: MARK; Value: MARK; Part Type: MARK; Created by: JJJ
Q9501 = MOSFET N: NMOS,2SK3018,SOT_323,Id=0.1A,Vds=30V; Part Reference: Q9501; Manufacturer: ROHM; Pd: 0.2W; Vgsth: 1.5V; VDS: 30V; Vgs: 20V; Id_max: 0.1A; Priority: A; Rds: 5ohm; Value: 2SK3018; Created by: JJJ; Manufacturer PN: 2SK3018; Part Type: NMOS; RK PN: 2SK3018
R9900 = RESISTOR_Dup1: НЁУГєсД¤µзЧи,0R,+/-5%,R0805,1/8W.; Part Reference: R9900; Manufacturer PN: RC0805JR-070RL; Manufacturer: YAGEO; Wattage: 1/8W; Priority: A; Value: 0R; Created by: YTL; Part Type: НЁУГєсД¤µзЧи; RK PN: RC0805JR-070RL
R9901 = RESISTOR_Dup1: НЁУГєсД¤µзЧи,0R,+/-5%,R0805,1/8W.; Part Reference: R9901; Manufacturer PN: RC0805JR-070RL; Manufacturer: YAGEO; Wattage: 1/8W; Priority: A; Value: 0R; Created by: YTL; Part Type: НЁУГєсД¤µзЧи; RK PN: RC0805JR-070RL
R9902 = RESISTOR_Dup1: НЁУГєсД¤µзЧи,1K,+/-5%,R0402,1/16W.; Part Reference: R9902; Manufacturer: YAGEO; RK PN: RC0402JR-071KL; Priority: A; Wattage: 1/16W; PCB Footprint: R0402; Value: 1K; Part Type: НЁУГєсД¤µзЧи; Manufacturer PN: RC0402JR-071KL; Created by: YTL
R9904 = RESISTOR_Dup1: НЁУГєсД¤µзЧи,10K,+/-5%,R0402,1/16W.; Part Reference: R9904; Manufacturer PN: RC0402JR-0710KL; Manufacturer: YAGEO; Wattage: 1/16W; Priority: A; PCB Footprint: R0402; Value: 10K; Created by: YTL; Part Type: НЁУГєсД¤µзЧи; RK PN: RC0402JR-0710KL
R9905 = RESISTOR_Dup1: НЁУГєсД¤µзЧи,10K,+/-5%,R0402,1/16W.; Part Reference: R9905; Manufacturer PN: RC0402JR-0710KL; Manufacturer: YAGEO; Wattage: 1/16W; Priority: A; PCB Footprint: R0402; Value: 10K; Created by: YTL; Part Type: НЁУГєсД¤µзЧи; RK PN: RC0402JR-0710KL
SMTSO9900 = SMTSO: єёЅУВЭДёM3,ёЯ¶И5mmЈ»; Part Reference: SMTSO9900; Value: SMTSO3050CTJ; Priority: A; RK PN: SMTSO3050CTJ; Part Type: SMTSO; Created by: JJJ
U9900 = CON4_0: Part Reference: U9900; Value: CN4M_2R54_V; PCB Footprint: CN4M_2R54_V_P_DIP